# EAGLE schematic test (EAGLE 6.5.0)
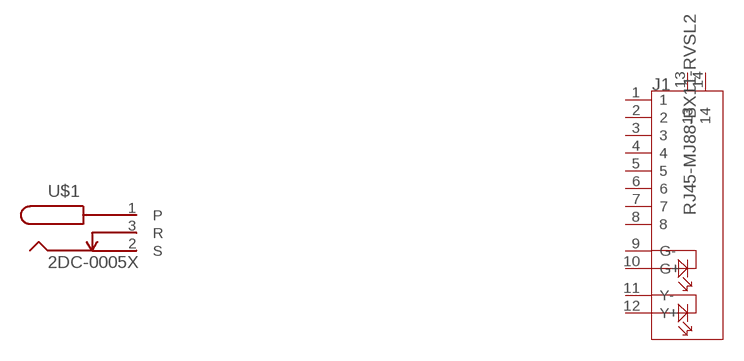
[diagram p0: schematic, sheet 1]

## Parts
J1  RJ45-MJ88-BX11-RVSL2  [RJ45-MJ88-BX11-RVSL2]
U$1  2DC-0005X  [2DC-0005D]
Unconnected: J1.1 J1.2 J1.3 J1.4 J1.5 J1.6 J1.7 J1.8 J1.9(G-) J1.10(G+) J1.11(Y-) J1.12(Y+) J1.13 J1.14 U$1.3(R)

## Power pins joined to a net without a drawn wire
P: U$1.1(P)
S: U$1.2(S)

## Library data of the parts
J1 = Connector :RJ45-MJ88-BX11-RVSL2: Modular Jack 8P8C,R/A,With LED
U$1 = marushin:2DC-0005X